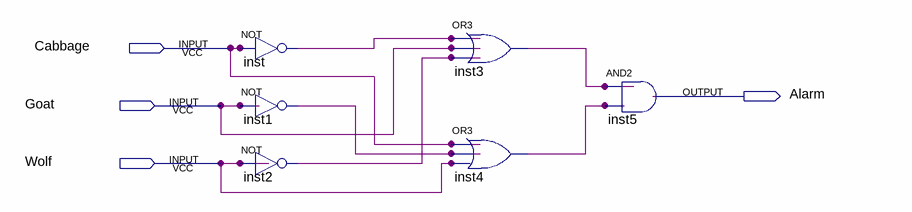
[diagram p0: schematic sheet]
// Quartus schematic lab3step0.bdf as structural Verilog: 6 symbols, 4 pins
module lab3step0 (
  input  Cabbage,
  input  Goat,
  input  Wolf,
  output Alarm
);

  wire inst1_out, inst2_out, inst3_out, inst4_out, inst_out;

  not inst (inst_out, Cabbage);
  not inst1 (inst1_out, Goat);
  not inst2 (inst2_out, Wolf);
  or inst3 (inst3_out, inst_out, Goat, inst2_out);
  or inst4 (inst4_out, Cabbage, inst1_out, Wolf);
  and inst5 (Alarm, inst3_out, inst4_out);
endmodule
